# Altium schematic sheet 8_SD卡电路.SchDoc
size A4
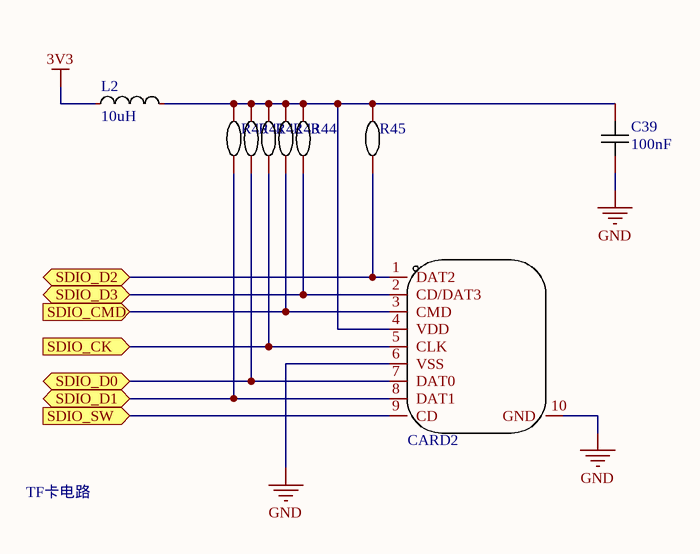
[diagram p0: 8_SD卡电路.SchDoc]

## Parts
C39  100nF  [0603C]
CARD2  TF-02A  [TF-SMD_TF-02]  (value not drawn)
L2  10uH  [L0603]
R40  (no value)  [0402R]
R41  (no value)  [0402R]
R42  (no value)  [0402R]
R43  (no value)  [0402R]
R44  (no value)  [0402R]
R45  (no value)  [0402R]

## Ports
SDIO_CK (in), SDIO_CMD (in), SDIO_D0 (bidir), SDIO_D1 (bidir), SDIO_D2, SDIO_D3 (bidir), SDIO_SW (in)

## Nets
3V3: L2.1
GND: C39.1 CARD2.6(VSS) CARD2.10(GND)
SDIO_CK: CARD2.5(CLK) R42.1 ; port SDIO_CK
SDIO_CMD: CARD2.3(CMD) R43.1 ; port SDIO_CMD
SDIO_D0: CARD2.7(DAT0) R41.1 ; port SDIO_D0
SDIO_D1: CARD2.8(DAT1) R40.1 ; port SDIO_D1
SDIO_D2: CARD2.1(DAT2) R45.1 ; port SDIO_D2
SDIO_D3: CARD2.2(CD/DAT3) R44.1 ; port SDIO_D3
SDIO_SW: CARD2.9(CD) ; port SDIO_SW
NetC39_2: C39.2 CARD2.4(VDD) L2.2 R40.2 R41.2 R42.2 R43.2 R44.2 R45.2

## Notes on the sheet
- TF卡电路

## Library data of the parts
C39 = CAP_0603: Symbol: CapAcitance; Convert to PCB: yes; Device: CAP_0603; Add into BOM: yes; Supplier Footprint: 0603; Value: 100nF; Name: 100nF
CARD2 = TF-02A: Symbol: TF-02A_C2889261; Add into BOM: yes; Maximum Body Height: 2mm; Device: TF-02A; Supplier Part: C2889261; Manufacturer Part: TF-02A; Supplier Footprint: SMD; JLCPCB Part Class: Extended Part; Datasheet: https://atta.szlcsc.com/upload/public/pdf/source/20210830/024A9A7E12D3087F16F1466156B6A08F.pdf; Supplier: LCSC; Convert to PCB: yes; Operating Temperature Range: -; Name: TF-02A
L2 = L_0603: Symbol: SDFL1608S100KTF; Add into BOM: yes; Device: L_0603; Supplier Footprint: L0603; Convert to PCB: yes; Value: 10uH; Name: 10uH
R40-R45 = RC0402FR-0710KL: Add into BOM: yes; Power(Watts): 62.5mW; Overload Voltage (Max): 50V; Device: RC0402FR-0710KL; Supplier Part: C60490; Manufacturer Part: RC0402FR-0710KL; Supplier Footprint: 0402; JLCPCB Part Class: Extended Part; Datasheet: https://atta.szlcsc.com/upload/public/pdf/source/20170606/1496716515432.pdf; Supplier: LCSC; Convert to PCB: yes